# EAGLE schematic timer_arduino_two (EAGLE 9.3.1)
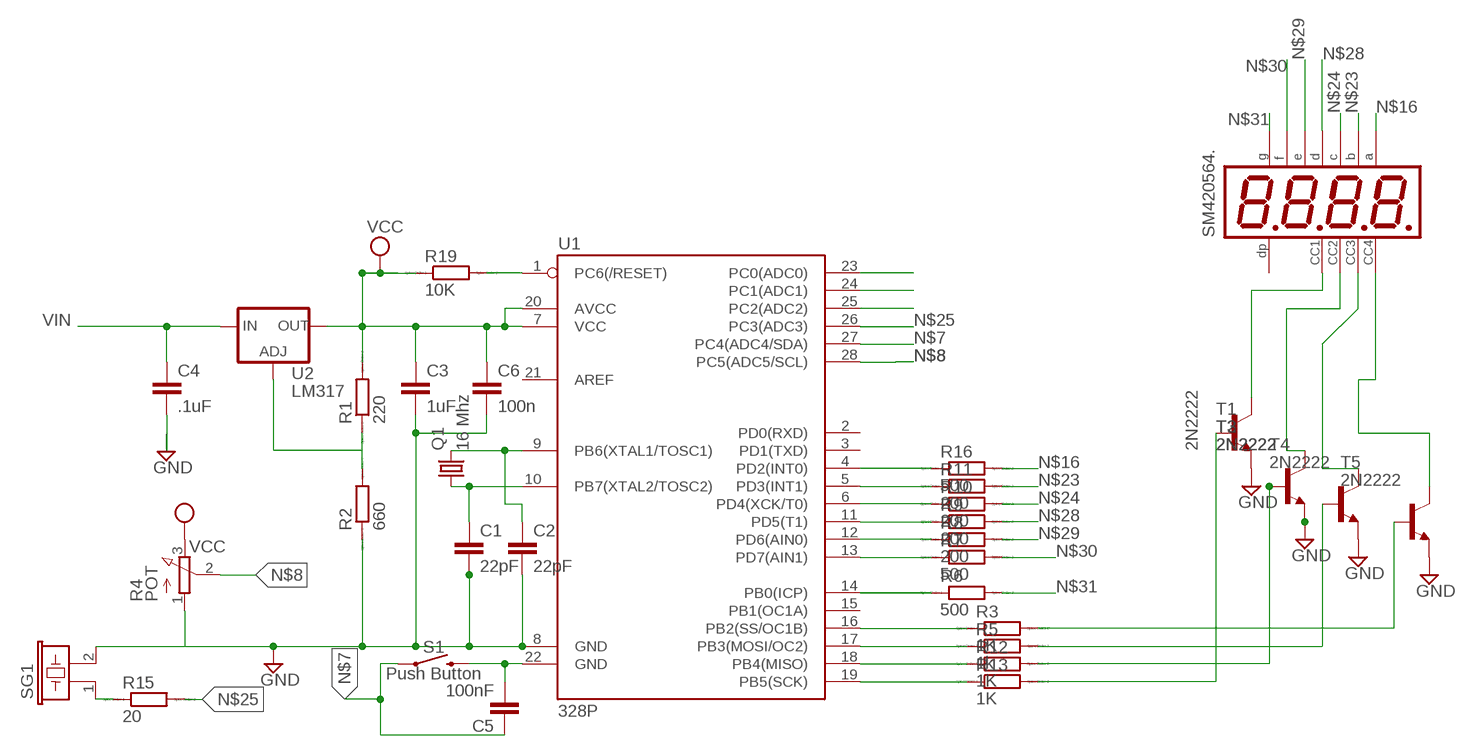
[diagram p0: schematic, sheet 1]

## Parts
C1  22pF  C2,5-3  [C2.5-3]
C2  22pF  C2,5-3  [C2.5-3]
C3  1uF  C2,5-3  [C2.5-3]
C4  .1uF  C2,5-3  [C2.5-3]
C5  100nF  C2,5-3  [C2.5-3]
C6  100n  C2,5-3  [C2.5-3]
Q1  16 Mhz  CRYSTALHC18U-V  [HC18U-V]
R1  220  RR2010  [R2010]
R2  660  RR2010  [R2010]
R3  1K  R  [R0805]
R4  POT  3RP/1610N  [3RP/1610N]
R5  1k  R  [R0805]
R6  500  R  [R0805]
R7  500  R  [R0805]
R8  200  R  [R0805]
R9  200  R  [R0805]
R10  200  R  [R0805]
R11  200  R  [R0805]
R12  1K  R  [R0805]
R13  1K  R  [R0805]
R15  20  RR0402  [R0402]
R16  500  R  [R0805]
R19  10K  RR0402  [R0402]
S1  Push Button  MOMENTARY-SWITCH-SPST-PTH-6.0MM  [TACTILE_SWITCH_PTH_6.0MM]
SG1  B/C11L  [B/C11L]
SM420564.  NFD-5641AS  [NFD-5641]
T1  2N2222  [TO18]
T2  2N2222  [TO18]
T3  2N2222  [TO18]
T4  2N2222  [TO18]
T5  2N2222  [TO18]
U1  328P  ATMEGA328P_PDIP  [DIP28]
U2  LM317  V_REG_317DPACK  [V-REG_DPACK]

## Nets
GND: C1.2 C2.2 C3.2 C6.2 R2.1 R4.1(A) SG1.2 T1.1(E) T2.1(E) T3.1(E) T4.1(E) T5.1(E) U1.8(GND)
N$1: C2.1 Q1.2 U1.9(PB6(XTAL1/TOSC1))
N$2: C1.1 Q1.1 U1.10(PB7(XTAL2/TOSC2))
N$3: R16.1 U1.4(PD2(INT0))
N$4: C5.1 S1.1
N$5: C5.2 S1.3 U1.22(GND)
N$6: U2.1(ADJ)
N$7: U1.27(PC4(ADC4/SDA))
N$8: R4.2(S) U1.28(PC5(ADC5/SCL))
N$9: R15.1 SG1.1
N$10: U1.23(PC0(ADC0))
N$11: U1.24(PC1(ADC1))
N$12: U1.25(PC2(ADC2))
N$13: U1.26(PC3(ADC3))
N$14: R13.1 U1.19(PB5(SCK))
N$15: R12.1 U1.18(PB4(MISO))
N$16: R16.2 SM420564..P$11
N$17: R11.1 U1.5(PD3(INT1))
N$18: R10.1 U1.6(PD4(XCK/T0))
N$19: R9.1 U1.11(PD5(T1))
N$20: R8.1 U1.12(PD6(AIN0))
N$21: R7.1 U1.13(PD7(AIN1))
N$22: R6.1 U1.14(PB0(ICP))
N$23: R11.2 SM420564..P$7
N$24: R10.2 SM420564..P$4
N$25: R15.2
N$26: C4.2
N$27: R1.1 R2.2
N$28: R9.2 SM420564..P$2
N$29: R8.2 SM420564..P$1
N$30: R7.2 SM420564..P$10
N$31: R6.2 SM420564..P$5
N$35: R5.1 U1.17(PB3(MOSI/OC2))
N$36: R3.1 U1.16(PB2(SS/OC1B))
N$37: R12.2 T2.2(B) T3.2(B)
N$39: SM420564..P$9 T2.3(C) T3.3(C)
N$40: R19.2 U1.1(PC6(/RESET))
N$41: SM420564..P$12 T1.3(C)
N$42: SM420564..P$8 T4.3(C)
N$43: SM420564..P$6 T5.3(C)
N$44: R13.2 T1.2(B)
N$45: R5.2 T4.2(B)
N$46: R3.2 T5.2(B)
VCC: C3.1 C6.1 R1.2 R4.3(E) R19.1 U1.7(VCC) U1.20(AVCC) U2.4(OUT)
VIN: C4.1 U2.3(IN)
Unconnected: SM420564..P$3 U1.2(PD0(RXD)) U1.3(PD1(TXD)) U1.15(PB1(OC1A)) U1.21(AREF)

## Library data of the parts
C1-C6 = capacitor-wima:C: CAPACITOR naming: grid - package width
Q1 = crystal:CRYSTAL: CRYSTAL; OC_FARNELL: unknown; OC_NEWARK: unknown
R1-R3 R5-R13 R15 R16 R19 = eagle-ltspice:R: RESISTOR, European symbol; SPICEMODEL: NONE; SPICEPREFIX: R
R4 = pot:3RP/1610N: 16mm Potentiometer one level Source: http://www.alphapotentiometers.net/html/16mm_pot_2.html
S1 = SparkFun-Switches:MOMENTARY-SWITCH-SPST: Momentary Switch (Pushbutton) - SPST Normally-open (NO) SPST momentary switches (buttons, pushbuttons). Variants PTH-12MM - 12mm square, through-hole Momentary Pushbutton Switch - 12mm Square <https://www.sparkfun.com/products/9190> (COM-09190) PTH-6.0MM, PTH-6.0MM-KIT - 6.0mm square, through-hole Mini Pushbutton Switch <https://www.sparkfun.com/products/97> (COM-00097) KIT package intended for soldering kit's - only one side of pads' copper is exposed. PTH-RIGHT-ANGLE-KIT - Right-angle, through-hole Right Angle Tactile Button <https://www.sparkfun.com/products/10791> - Used on SparkFun BigTime Watch Kit <https://www.sparkfun.com/products/11734> SMD-12MM - 12mm square, surface-mount Tactile Button - SMD (12mm) <https://www.sparkfun.com/products/12993> (COM-12993) Used on SparkFun PicoBoard <https://www.sparkfun.com/products/11888> SMD-4.5MM - 4.5mm Square Trackball Switch Used on SparkFun Blackberry Trackballer Breakout <https://www.sparkfun.com/products/13169> SMD-4.6MMX2.8MM - 4.60mm x 2.80mm, surface mount Used on SparkFun SAMD21 Mini Breakout <https://www.sparkfun.com/products/13664> SMD-5.2MM, SMD-5.2-REDUNDANT - 5.2mm square, surface-mount Mini Pushbutton Switch - SMD <https://www.sparkfun.com/products/8720> (COM-08720) Used on Arduino Pro Mini <https://www.sparkfun.com/products/11114> REDUNDANT package connects both switch circuits together SMD-6.0X3.5MM - 6.0 x 3.5mm, surface mount Momentary Reset Switch SMD <https://www.sparkfun.com/products/8229> (COM-08229) SMD-6.2MM-TALL - 6.2mm square, surface mount Tactile Button - SMD (6mm) <https://www.sparkfun.com/products/12992> Used on SparkFun Digital Sandbox <https://www.sparkfun.com/products/12651> SMD-RIGHT-ANGLE - Right-angle, surface mount Used on SparkFun Block for Intel® Edison - Arduino <https://www.sparkfun.com/products/13036>; PROD_ID: SWCH-08441; SF_SKU: COM-00097
SG1 = buzzer:B/C11L: BUZZER Source: Buerklin; OC_FARNELL: unknown; OC_NEWARK: unknown
SM420564. = display-nfd:NFD-5641AS: Four Digit 0.56" CC Seven-Segment LED Display Futurlec part number: 7FR5641AS Created by RobG
T1-T5 = transistor:2N2222: NPN TRANSISTOR
U1 = SparkFun-IC-Microcontroller:ATMEGA328P_PDIP: Atmel 328P Through hole ATMEGA328P uC used in the Arduino 32kb flash, 1k EEPROM, 2k SRAM Datasheet <http://www.sparkfun.com/datasheets/Components/SMD/ATMega328.pdf> SparkFun Products Storefront component: AVR 28 Pin 20MHz 32K 6A/D - ATMega328P <https://www.sparkfun.com/products/9061> (COM-09061) SparkFun Simon Says - Through-Hole Soldering Kit <https://www.sparkfun.com/products/10547> (KIT-10547) SparkFun Learn to Solder - Simon Says <https://www.sparkfun.com/products/13708> (KIT-13708) SparkFun BigTime Watch Kit <https://www.sparkfun.com/products/11734> (KIT-11734) SparkFun ClockIt <https://www.sparkfun.com/products/10930> (KIT-10930) SparkFun Serial Enabled LCD Kit <https://www.sparkfun.com/products/10097> (LCD-10097) SparkFun Simon Tilts - Through Hole Soldering Kit <https://www.sparkfun.com/products/12634> (KIT-12634) SparkFun Frequency Counter Kit <https://www.sparkfun.com/products/10140> (KIT-10140) FabFM Radio Kit <https://www.sparkfun.com/products/11043> (KIT-11043) SparkFun Binary Blaster Kit <https://www.sparkfun.com/products/12037> (KIT-12037) SparkFun Metro-Gnome <https://www.sparkfun.com/products/9236> (KIT-09236) ATmega328 with Arduino Optiboot (Uno) <https://www.sparkfun.com/products/10524> (DEV-10524); PROD_ID: IC-09136
U2 = SparkFun-IC-Power:V_REG_317: Voltage Regulator Standard LM317 adjustable voltage regulator. AOI (Adjust Output Input). Google 'LM317 Calculator' for easy to use app to get the two resistor values needed. 240/720 for 5V output. 240/390 for 3.3V output. Spark Fun Electronics SKU : COM-00527; PROD_ID: IC-09888